# Altium schematic sheet clouds_v302_2.SchDoc: clouds_v302
size 409 x 282 mm; Date: 3/31/2017 1:28:51 PM; SheetNumber: 3
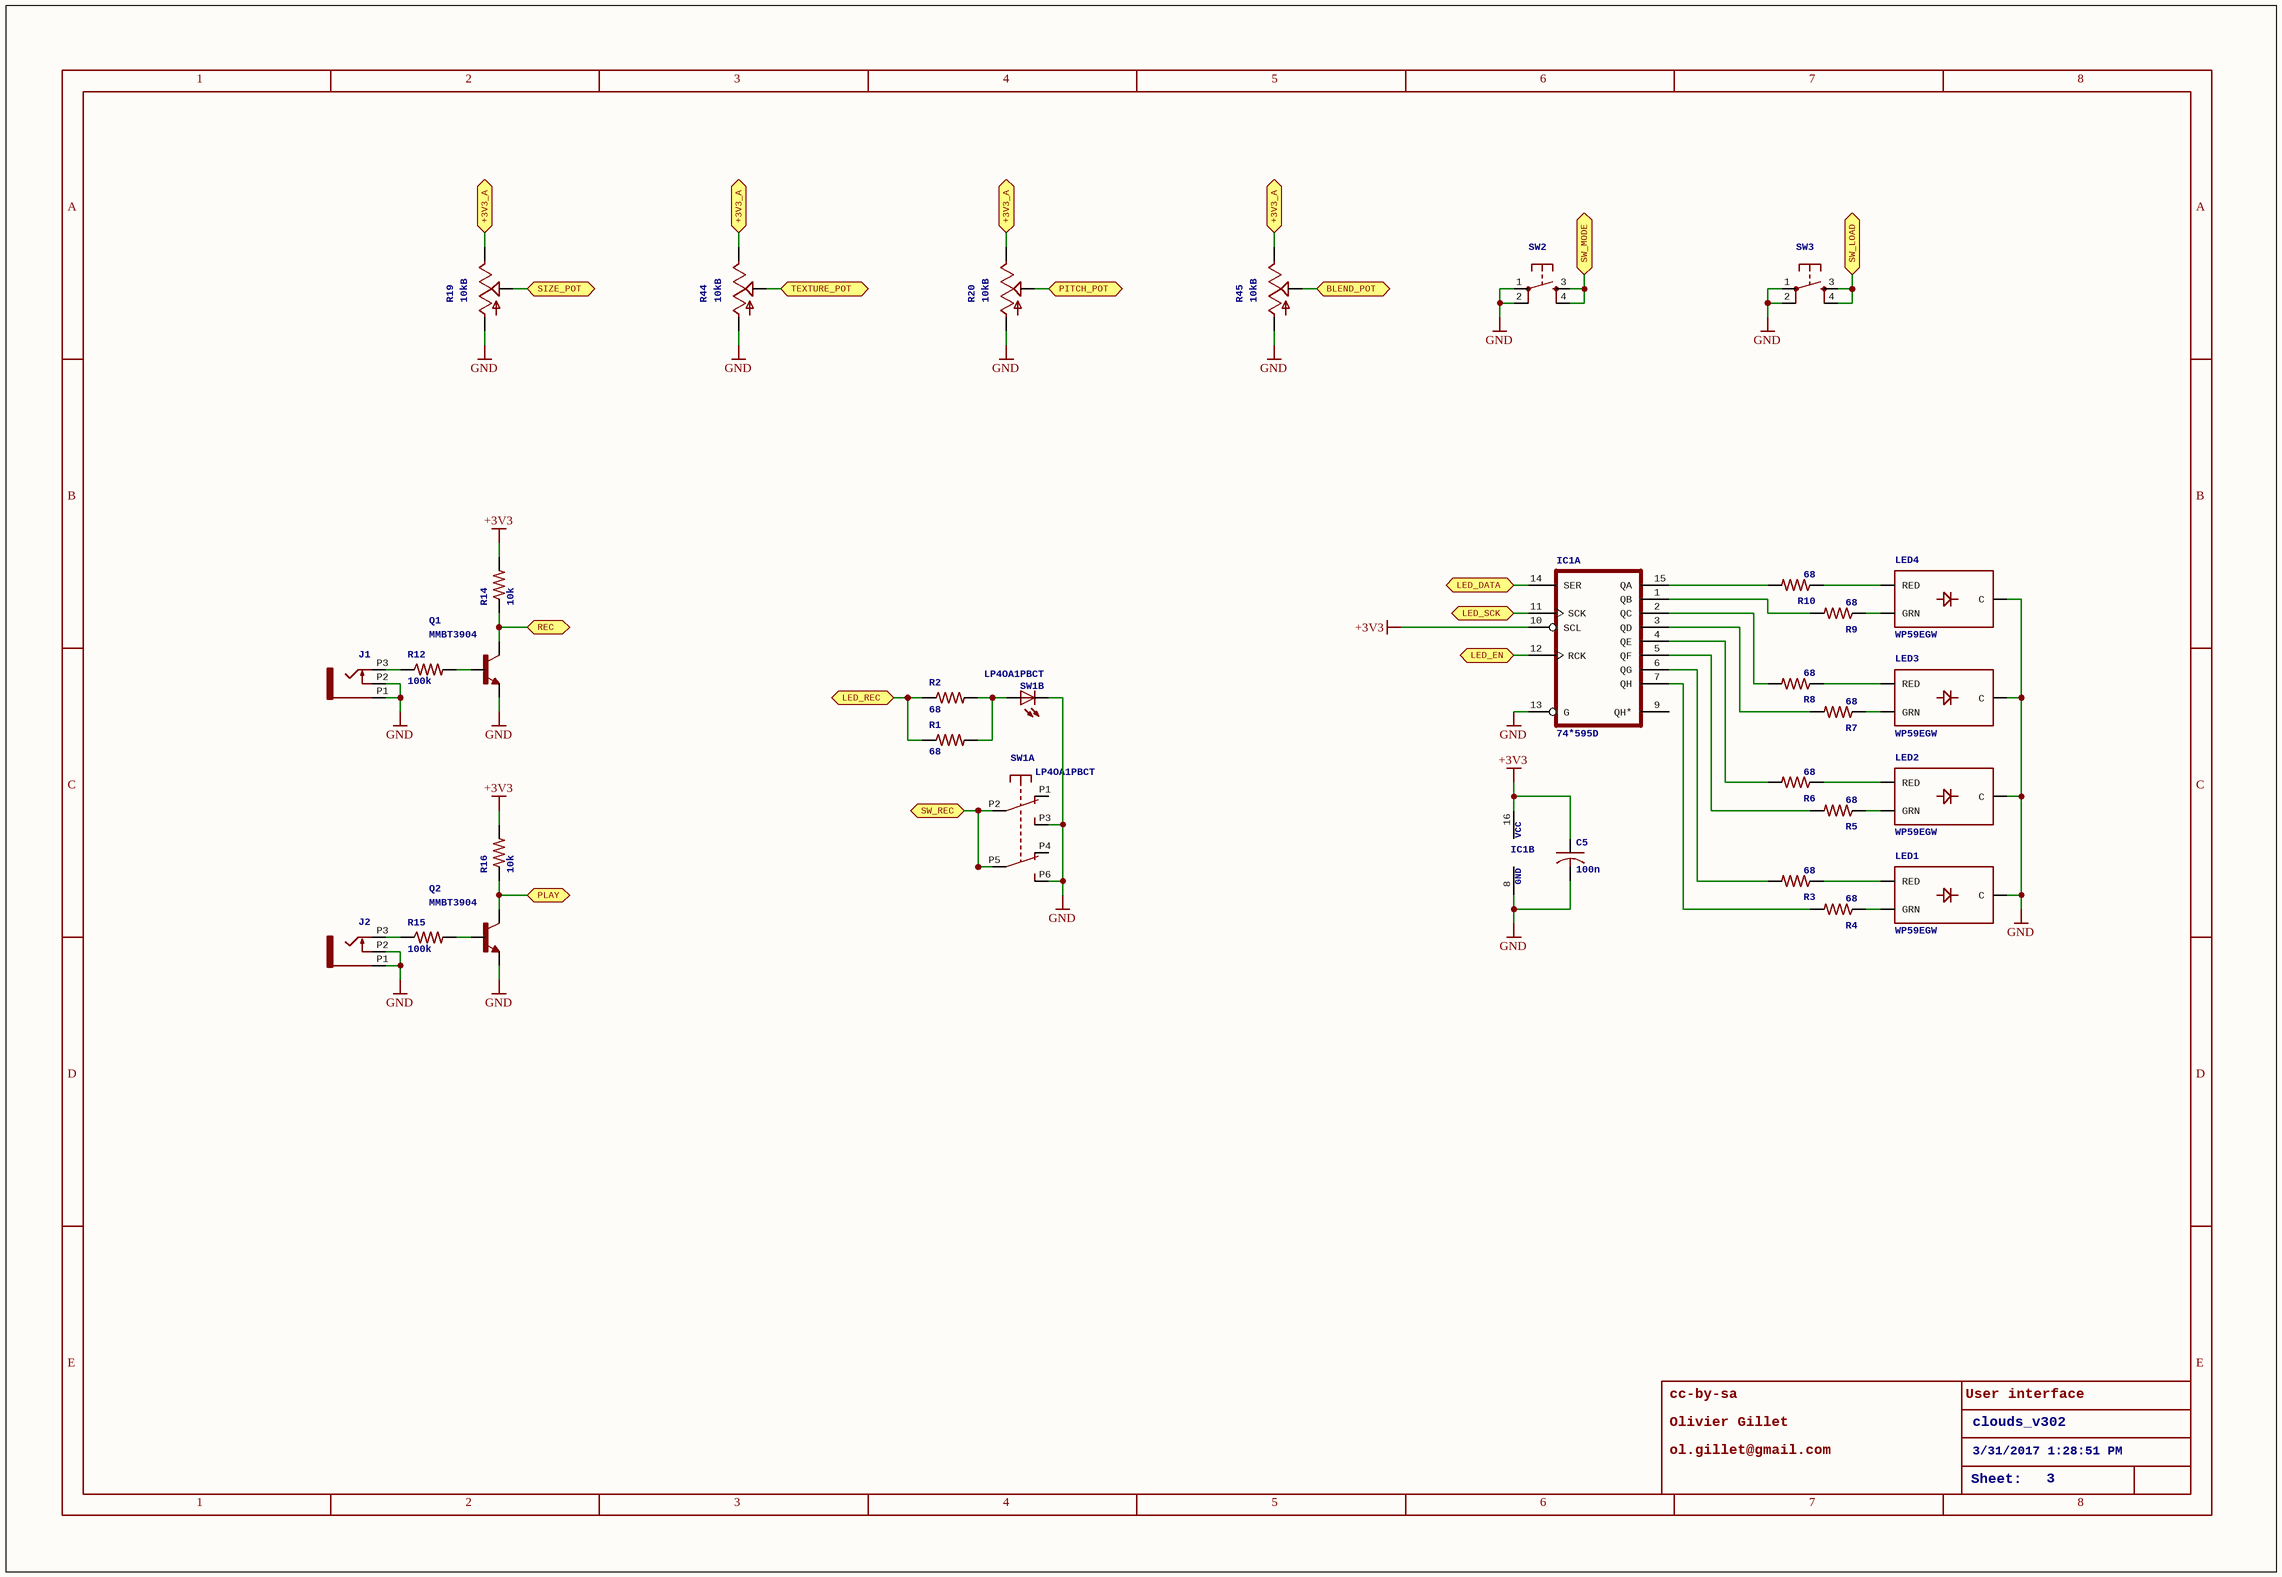
[diagram p0: clouds_v302_2.SchDoc]

## Parts
C5  100n  [C0603]
IC1  74*595D  [SO16]  (parts A,B of 2)
J1  PJ301_THONKICONN6  [WQP_PJ_301M6]  (value not drawn)
J2  PJ301_THONKICONN6  [WQP_PJ_301M6]  (value not drawn)
LED1  WP59EGW  [LED-BICOLOR-THROUGHHOLE-5MM]
LED2  WP59EGW  [LED-BICOLOR-THROUGHHOLE-5MM]
LED3  WP59EGW  [LED-BICOLOR-THROUGHHOLE-5MM]
LED4  WP59EGW  [LED-BICOLOR-THROUGHHOLE-5MM]
Q1  MMBT3904  [SOT23-BEC]
Q2  MMBT3904  [SOT23-BEC]
R1  68  [R0603]
R2  68  [R0603]
R3  68  [R0603]
R4  68  [R0603]
R5  68  [R0603]
R6  68  [R0603]
R7  68  [R0603]
R8  68  [R0603]
R9  68  [R0603]
R10  68  [R0603]
R12  100k  [R0603]
R14  10k  [R0603]
R15  100k  [R0603]
R16  10k  [R0603]
R19  10kB  [ALPS_POT_VERTICAL_PS]
R20  10kB  [ALPS_POT_VERTICAL_PS]
R44  10kB  [ALPS_POT_VERTICAL_PS]
R45  10kB  [ALPS_POT_VERTICAL_PS]
SW1  LP4OA1PBCT  [LP4OA1PBCT]  (parts A,B of 2)
SW2  TAC_SWITCHPTH  [TACTILE-PTH]  (value not drawn)
SW3  TAC_SWITCHPTH  [TACTILE-PTH]  (value not drawn)

## Ports
+3V3_A, BLEND_POT, LED_DATA, LED_EN, LED_REC, LED_SCK, PITCH_POT, PLAY, REC, SIZE_POT, SW_LOAD, SW_MODE, SW_REC, TEXTURE_POT

## Nets
+3V3: C5.1 IC1.10(SCL) IC1.16(VCC) R14.2 R16.2
GND: C5.2 IC1.8(GND) IC1.13(G) J1.P1 J1.P2 J2.P1 J2.P2 LED1.2(C) LED2.2(C) LED3.2(C) LED4.2(C) Q1.E Q2.E R19.P$3(A) R20.P$3(A) R44.P$3(A) R45.P$3(A) SW1.L2 SW1.P3(A3) SW1.P6(B3) SW2.1 SW2.2 SW3.1 SW3.2
+3V3_A: R19.P$1(E) R20.P$1(E) R44.P$1(E) R45.P$1(E) ; port +3V3_A
BLEND_POT: R45.P$2(S) ; port BLEND_POT
LED_DATA: IC1.14(SER) ; port LED_DATA
LED_EN: IC1.12(RCK) ; port LED_EN
LED_REC: R1.1 R2.1 ; port LED_REC
LED_SCK: IC1.11(SCK) ; port LED_SCK
PITCH_POT: R20.P$2(S) ; port PITCH_POT
PLAY: Q2.C R16.1 ; port PLAY
REC: Q1.C R14.1 ; port REC
SIZE_POT: R19.P$2(S) ; port SIZE_POT
SW_LOAD: SW3.3 SW3.4 ; port SW_LOAD
SW_MODE: SW2.3 SW2.4 ; port SW_MODE
SW_REC: SW1.P2(A2) SW1.P5(B2) ; port SW_REC
TEXTURE_POT: R44.P$2(S) ; port TEXTURE_POT
NetIC1_1: IC1.1(QB) R9.2
NetIC1_2: IC1.2(QC) R8.2
NetIC1_3: IC1.3(QD) R7.2
NetIC1_4: IC1.4(QE) R6.2
NetIC1_5: IC1.5(QF) R5.2
NetIC1_6: IC1.6(QG) R3.2
NetIC1_7: IC1.7(QH) R4.2
NetIC1_15: IC1.15(QA) R10.2
NetJ1_P3: J1.P3 R12.1
NetJ2_P3: J2.P3 R15.1
NetLED1_1: LED1.1(RED) R3.1
NetLED1_3: LED1.3(GRN) R4.1
NetLED2_1: LED2.1(RED) R6.1
NetLED2_3: LED2.3(GRN) R5.1
NetLED3_1: LED3.1(RED) R8.1
NetLED3_3: LED3.3(GRN) R7.1
NetLED4_1: LED4.1(RED) R10.1
NetLED4_3: LED4.3(GRN) R9.1
NetQ1_B: Q1.B R12.2
NetQ2_B: Q2.B R15.2
NetR1_2: R1.2 R2.2 SW1.L1

Not connected (* = marked no-connect by the designer): IC1 9(QH*); SW1 P1(A1) P4(B1)

## Notes on the sheet
- cc-by-sa
- Olivier Gillet
- ol.gillet@gmail.com
- User interface
- clouds_v302
- 3/31/2017 1:28:51 PM
- Sheet:
- 3
- 1
- 2
- 4
- 5
- 6
- 7
- 8
- A
- B
- C
- D
- E

## Library data of the parts
C5 = C-USC0603: CAPACITOR, American symbol
IC1 = 74*595D: 8-bit SHIFT REGISTER, output latch
LED1-LED4 = LED-BICOLOR-THROUGHHOLE5MM
Q1 Q2 = *-NPN-SOT23-BEC: NPN Transistror   BF959 corrected 2008.03.06
R1-R10 R12 R14-R16 = R-US_R0603: RESISTOR, American symbol
R19 R20 R44 R45 = POT_USVERTICAL_PS
SW2 SW3 = TAC_SWITCHPTH: Momentary SwitchButton commonly used for reset or general input. Spark Fun Electronics SKU : COM-00097